# EAGLE design gc_adapt (EAGLE 9.6.2)
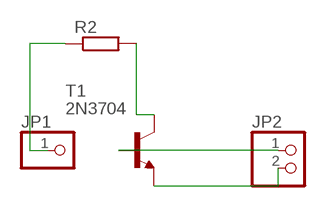
[diagram p0: schematic, sheet 1]

## Parts
JP1  PINHD-1X1  [1X01]
JP2  PINHD-1X2  [1X02]
R2  R-EU_0204/5  [0204/5]
T1  2N3704  [TO92]

## Nets
N$1: JP2.1 T1.1(B)
N$2: JP2.2 T1.3(E)
N$3: R2.2 T1.2(C)
N$4: JP1.1 R2.1

## Library data of the parts
JP1 = pinhead:PINHD-1X1: PIN HEADER
JP2 = pinhead:PINHD-1X2: PIN HEADER
R2 = rcl:R-EU_: RESISTOR, European symbol; SPICEPREFIX: R
T1 = transistor:2N3704: NPN TRANSISTOR

## Board
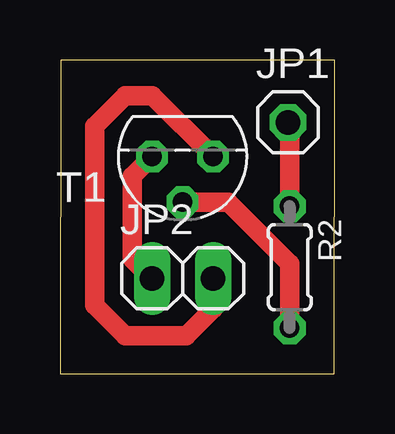
[diagram p1: board, top side]

Size 11.46 x 13.07 mm. Coordinates in mm from the lower left corner, seen from the top.
Outline: 0,0 11.43,0 11.46,13.07 0.03,13.07 0,0
Copper layers (1*16): Top 0.035mm / dielectric 1.5mm / Bottom 0.035mm
Design rules "default": minimum track width 6mil, minimum drill 0.35mm, track to track 6mil, track to pad 6mil, pad to pad 6mil, via to via 6mil, smd to smd 6mil, copper to edge 40mil, drill to drill 6mil, minimum pad ring 10mil, minimum via ring 8mil, stop-mask expansion 4mil, vias tented up to drill 0mil, thermal gap 10mil

### Footprints (pad centres in the part's own frame; a part is rotated, then mirrored left to right if it is on the bottom)
1X01 = drill 1.016 octagon: 1 0,0
1X02 = drill 1.016 long: 1 -1.27,0; 2 1.27,0
0204/5 = drill 0.813 octagon: 1 -2.54,0; 2 2.54,0
TO92 = drill 0.813 octagon: 1 1.27,0; 2 0,1.905; 3 -1.27,0

### Placement (x,y rotation side)
JP1  9.5,10.47 0 top
JP2  5.11,3.96 0 top
R2  9.57,4.43 270 top
T1  5.11,9.04 180 top

### Tracks (layer width: path | path; a pad name or v marks a point on that pad's centre or on a via)
N$1
  Top 0.813: JP2.1 3.01,4.79 3.01,8.22 T1.1
N$2
  Top 0.813: T1.3 3.84,11.58 2.72,11.58 1.45,10.31 1.45,2.85 2.72,1.58 5.26,1.58 6.38,2.69 JP2.2
N$3
  Top 0.813: T1.2 7.01,7.14 9.57,4.58 R2.2
N$4
  Top 0.813: R2.1 9.57,10.4 JP1.1